# EAGLE design nes_controller_v1.0_v7 (EAGLE 7.7.0)
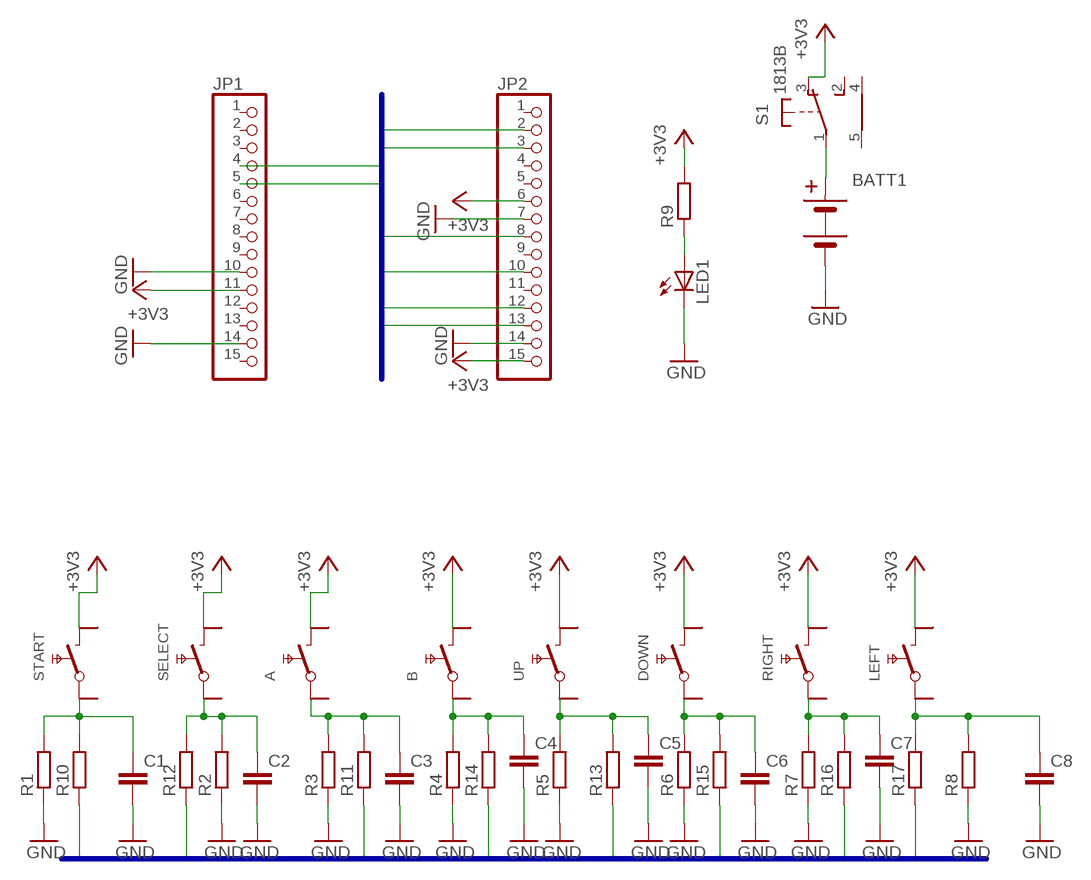
[diagram p0: schematic, sheet 1]

## Parts
A  SMDTAST  [SMDTAST]
B  SMDTAST  [SMDTAST]
BATT1  BATTERIEHALTER_2X_AAA  [BATTERIEHALTER]
C1  C-EUC0805K  [C0805K]
C2  C-EUC0805K  [C0805K]
C3  C-EUC0805K  [C0805K]
C4  C-EUC0805K  [C0805K]
C5  C-EUC0805K  [C0805K]
C6  C-EUC0805K  [C0805K]
C7  C-EUC0805K  [C0805K]
C8  C-EUC0805K  [C0805K]
DOWN  SMDTAST  [SMDTAST]
JP1  PINHD-1X15  [1X15]
JP2  PINHD-1X15  [1X15]
LED1  LED3MM  [LED3MM]
LEFT  SMDTAST  [SMDTAST]
R1  R-EU_MELF0207R  [MINI_MELF-0207R]
R2  R-EU_MELF0207R  [MINI_MELF-0207R]
R3  R-EU_MELF0207R  [MINI_MELF-0207R]
R4  R-EU_MELF0207R  [MINI_MELF-0207R]
R5  R-EU_MELF0207R  [MINI_MELF-0207R]
R6  R-EU_MELF0207R  [MINI_MELF-0207R]
R7  R-EU_MELF0207R  [MINI_MELF-0207R]
R8  R-EU_MELF0207R  [MINI_MELF-0207R]
R9  R-EU_MELF0207R  [MINI_MELF-0207R]
R10  R-EU_MELF0207R  [MINI_MELF-0207R]
R11  R-EU_MELF0207R  [MINI_MELF-0207R]
R12  R-EU_MELF0207R  [MINI_MELF-0207R]
R13  R-EU_MELF0207R  [MINI_MELF-0207R]
R14  R-EU_MELF0207R  [MINI_MELF-0207R]
R15  R-EU_MELF0207R  [MINI_MELF-0207R]
R16  R-EU_MELF0207R  [MINI_MELF-0207R]
R17  R-EU_MELF0207R  [MINI_MELF-0207R]
RIGHT  SMDTAST  [SMDTAST]
S1  1813B  [1813B]
SELECT  SMDTAST  [SMDTAST]
START  SMDTAST  [SMDTAST]
UP  SMDTAST  [SMDTAST]

## Nets
3§4: C2.1 R2.2 R12.2 SELECT.1
4$5: A.1 C3.1 R3.2 R11.2
+3V3: A.2 B.2 DOWN.2 JP1.11 JP2.6 JP2.15 LEFT.2 R9.2 RIGHT.2 S1.3(O) SELECT.2 START.2 UP.2
A: JP1.5 R11.1
B: JP1.4 R14.1
DOWN: JP2.8 R15.1
GND: BATT1.P- C1.2 C2.2 C3.2 C4.2 C5.2 C6.2 C7.2 C8.2 JP1.10 JP1.14 JP2.7 JP2.14 LED1.K(C) R1.1 R2.1 R3.1 R4.1 R5.1 R6.1 R7.1 R8.1
LEFT: JP2.10 R17.1
N$1: BATT1.P+ S1.1(W)
N$2: LED1.A R9.1
N$3: C1.1 R1.2 R10.2 START.1
N$4: B.1 C4.1 R4.2 R14.2
N$5: C5.1 R5.2 R13.2 UP.1
N$6: C6.1 DOWN.1 R6.2 R15.2
N$7: C7.1 R7.2 R16.2 RIGHT.1
N$8: C8.1 LEFT.1 R8.2 R17.2
RIGHT: JP2.13 R16.1
SELECT: JP2.2 R12.1
START: JP2.3 R10.1
UP: JP2.12 R13.1
Unconnected: A.11 A.22 B.11 B.22 DOWN.11 DOWN.22 JP1.1 JP1.2 JP1.3 JP1.6 JP1.7 JP1.8 JP1.9 JP1.12 JP1.13 JP1.15 JP2.1 JP2.4 JP2.5 JP2.9 JP2.11 LEFT.11 LEFT.22 RIGHT.11 RIGHT.22 S1.2(S) S1.4(SH1) S1.5(SH2) SELECT.11 SELECT.22 START.11 START.22 UP.11 UP.22

## Buses
SELECT,START,A,B,UP,DOWN,LEFT,RIGHT

## Library data of the parts
A B DOWN LEFT RIGHT SELECT START UP = Schalter-sh:SMDTAST
BATT1 = Taschenlampe:BATTERIEHALTER_2X_AAA: Batteriehalter 2x AAA, printbar
C1-C8 = rcl@1:C-EU: CAPACITOR, European symbol; SPICEPREFIX: C
JP1 JP2 = pinhead:PINHD-1X15: PIN HEADER
LED1 = led:LED: LED OSRAM: - CHIPLED LG R971, LG N971, LY N971, LG Q971, LY Q971, LO R971, LY R971 LH N974, LH R974 LS Q976, LO Q976, LY Q976 LO Q996 - Hyper CHIPLED LW Q18S LB Q993, LB Q99A, LB R99A - SideLED LS A670, LO A670, LY A670, LG A670, LP A670 LB A673, LV A673, LT A673, LW A673 LH A674 LY A675 LS A676, LA A676, LO A676, LY A676, LW A676 LS A679, LY A679, LG A679 - Hyper Micro SIDELED® LS Y876, LA Y876, LO Y876, LY Y876 LT Y87S - SmartLED LW L88C, LW L88S LB L89C, LB L89S, LG L890 LS L89K, LO L89K, LY L89K LS L896, LA L896, LO L896, LY L896 - TOPLED LS T670, LO T670, LY T670, LG T670, LP T670 LSG T670, LSP T670, LSY T670, LOP T670, LYG T670 LG T671, LOG T671, LSG T671 LB T673, LV T673, LT T673, LW T673 LH T674 LS T676, LA T676, LO T676, LY T676, LB T676, LH T676, LSB T676, LW T676 LB T67C, LV T67C, LT T67C, LS T67K, LO T67K, LY T67K, LW E67C LS E67B, LA E67B, LO E67B, LY E67B, LB E67C, LV E67C, LT E67C LW T67C LS T679, LY T679, LG T679 LS T770, LO T770, LY T770, LG T770, LP T770 LB T773, LV T773, LT T773, LW T773 LH T774 LS E675, LA E675, LY E675, LS T675 LS T776, LA T776, LO T776, LY T776, LB T776 LHGB T686 LT T68C, LB T68C - Hyper Mini TOPLED® LB M676 - Mini TOPLED Santana® LG M470 LS M47K, LO M47K, LY M47K Source: http://www.osram.convergy.de LUXEON: - LUMILED® LXK2-PW12-R00, LXK2-PW12-S00, LXK2-PW14-U00, LXK2-PW14-V00 LXK2-PM12-R00, LXK2-PM12-S00, LXK2-PM14-U00 LXK2-PE12-Q00, LXK2-PE12-R00, LXK2-PE12-S00, LXK2-PE14-T00, LXK2-PE14-U00 LXK2-PB12-K00, LXK2-PB12-L00, LXK2-PB12-M00, LXK2-PB14-N00, LXK2-PB14-P00, LXK2-PB14-Q00 LXK2-PR12-L00, LXK2-PR12-M00, LXK2-PR14-Q00, LXK2-PR14-R00 LXK2-PD12-Q00, LXK2-PD12-R00, LXK2-PD12-S00 LXK2-PH12-R00, LXK2-PH12-S00 LXK2-PL12-P00, LXK2-PL12-Q00, LXK2-PL12-R00 Source: www.luxeon.com KINGBRIGHT: KA-3528ASYC Source: www.kingbright.com
R1-R17 = rcl:R-EU_: RESISTOR, European symbol
S1 = Benutzer_WM:1813B

## Board
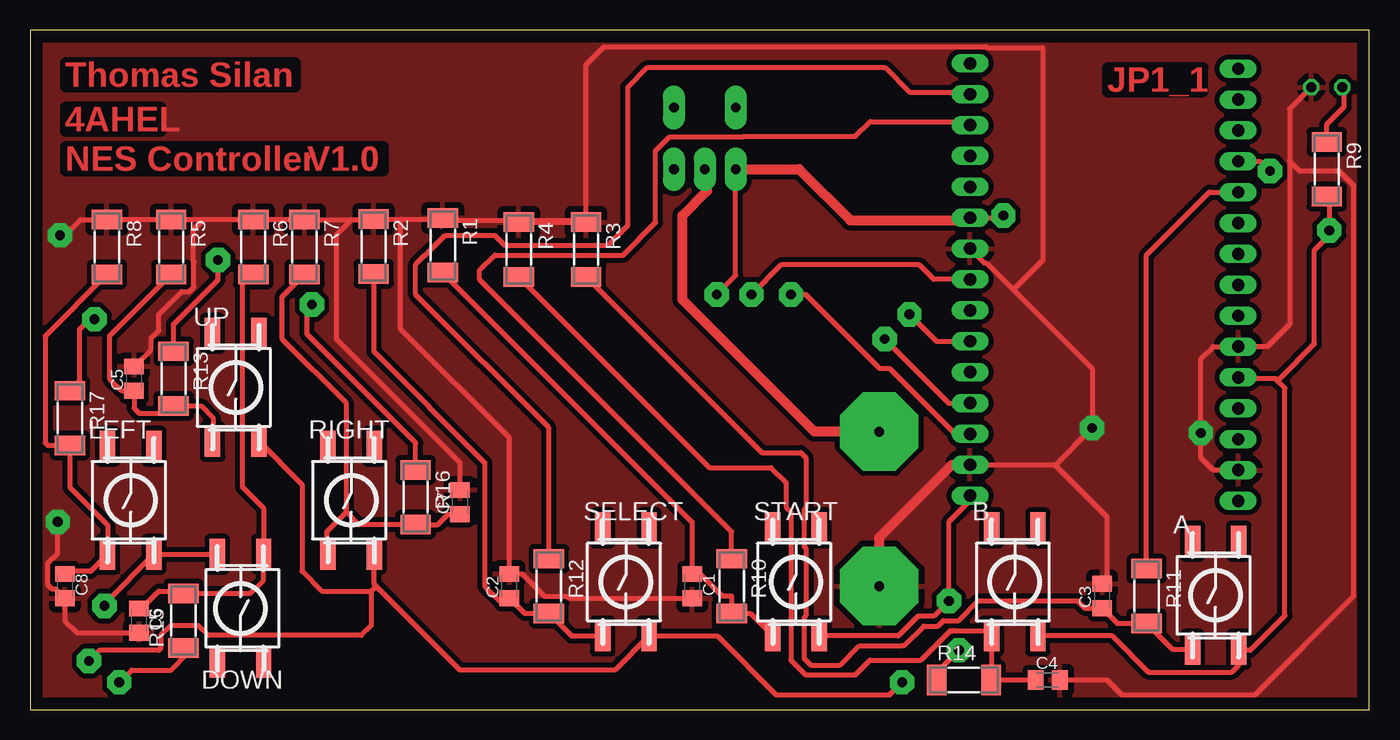
[diagram p1: board, top side]
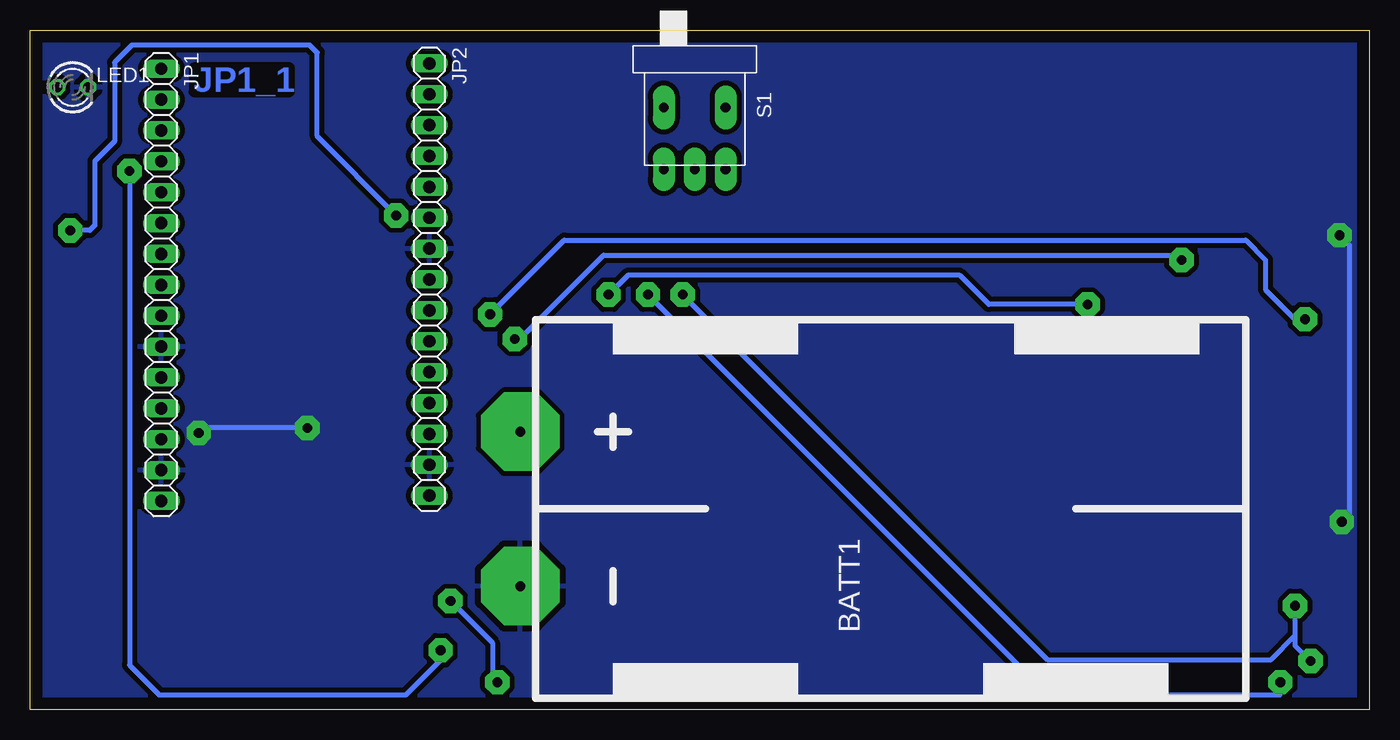
[diagram p2: board, bottom side, seen from below]

Size 110.16 x 55.87 mm. Coordinates in mm from the lower left corner, seen from the top.
Outline: 0,0 110.16,0 110.16,55.87 0,55.87 0,0
Copper layers (1*16): Top 0.035mm / dielectric 1.5mm / Bottom 0.035mm
Design rules "htl-klu": minimum track width 16mil, minimum drill 31mil, track to track 16mil, track to pad 16mil, pad to pad 16mil, via to via 16mil, smd to smd 12mil, copper to edge 40mil, drill to drill 16mil, minimum pad ring 10mil, minimum via ring 16mil, stop-mask expansion 4mil, vias tented up to drill 0mil, thermal gap 20mil

### Footprints (pad centres in the part's own frame; a part is rotated, then mirrored left to right if it is on the bottom)
SMDTAST = smd 1.27 x 2.54: 1 -1.905,-4.445; 2 1.905,-4.445; 11 -1.905,4.445; 22 1.905,4.445
BATTERIEHALTER = drill 0.813 pad 6.452 octagon: P+ 6.35,30.48; P- -6.35,30.48
C0805K = smd 1.3 x 1.6: 1 -1,0; 2 1,0
1X15 = drill 1.016 long: 1 -17.78,0; 2 -15.24,0; 3 -12.7,0; 4 -10.16,0; 5 -7.62,0; 6 -5.08,0; 7 -2.54,0; 8 0,0; 9 2.54,0; 10 5.08,0; 11 7.62,0; 12 10.16,0; 13 12.7,0; 14 15.24,0; 15 17.78,0
LED3MM = drill 0.813 octagon: A -1.27,0; K 1.27,0
MINI_MELF-0207R = smd 1.6 x 2.5: 1 -2.25,0; 2 2.25,0
1813B = drill 0.8 pad 1.8 long: 1 0,0; 2 0,2.54; 3 0,-2.54; 4 -5.08,2.54; 5 -5.08,-2.54

### Placement (x,y rotation side)
A  97.52,9.41 0 top
B  81,10.5 0 top
BATT1  39.37,16.51 90 bottom
C1  54.46,10.16 270 top
C2  39.42,10.16 90 top
C3  88.19,9.35 90 top
C4  83.72,2.44 0 top
C5  8.53,27.23 90 top
C6  8.94,7.32 270 top
C7  35.36,17.07 90 top
C8  2.84,10.16 270 top
DOWN  17.29,8.33 180 top
JP1  99.39,34.94 270 bottom
JP2  77.33,35.38 270 bottom
LED1  106.68,51.2 0 bottom
LEFT  8.26,17.22 0 top
R1  33.93,38.2 270 top
R2  28.24,38.1 270 top
R3  45.72,37.85 270 top
R4  40.18,37.85 270 top
R5  11.58,38.05 270 top
R6  18.34,38.05 270 top
R7  22.56,38.05 270 top
R8  6.3,38.05 270 top
R9  106.68,44.45 270 top
R10  57.71,10.16 270 top
R11  91.85,9.35 270 top
R12  42.67,10.16 270 top
R13  11.79,27.23 270 top
R14  76.81,2.44 0 top
R15  12.6,7.32 90 top
R16  31.7,17.48 270 top
R17  3.25,23.98 270 top
RIGHT  26.4,17.22 0 top
S1  55.5,44.45 270 bottom
SELECT  49,10.5 0 top
START  63,10.5 0 top
UP  16.9,26.5 0 top

### Tracks (layer width: path | path; a pad name or v marks a point on that pad's centre or on a via)
3§4
  Top 0.406: SELECT.1 44.53,6.05 R12.2 40.67,7.91 C2.1 39.2,8.94 38.61,8.94 37.39,10.16 37.39,20.32 28.25,29.46 R2.2
4$5
  Top 0.406: R3.2 60.18,21.13 63.4,21.13 63.8,20.73 63.8,16.61 63.66,16.47 63.66,13.42 63.8,13.28 63.8,7.72 63.66,7.58 63.66,4.21 64.21,3.66 66.65,3.66 68.23,5.24 71.76,5.24 71.8,5.28 71.93,5.28 73.52,6.87 74.67,6.87 75.11,7.32 76.4,7.32 78.03,8.94 86.16,8.94 86.75,8.35 C3.1 89.44,7.1 R11.2 93.98,4.96 A.1
+3V3  (via drill 0.8 pad 2)
  Top 0.406: 99.7,27.64 99.64,27.57 | 99.64,27.57 JP1.11 | A.2 99.42,4.88 | 99.42,4.88 99.42,3.66 98.85,3.08 92.01,3.08 89.04,6.05 B.2 | DOWN.2 LEFT.2 6.1,8.71 v6.1,8.53 | UP.2 22.35,18.51 22.35,11.38 23.98,9.75 28.04,9.75 | 28.04,9.75 28.45,10.16 | 28.45,10.16 28.3,10.3 RIGHT.2 | 28.45,10.16 35.36,3.25 48.1,3.25 SELECT.2 56.53,6.05 61.37,1.22 70.71,1.22 v71.73,2.25 | 99.42,4.88 100.38,4.88 103.23,7.72 103.23,26.42 102.41,27.23 | 99.64,27.57 99.97,27.23 102.41,27.23 | 102.41,27.23 102.82,27.23 105.66,30.07 105.66,37.8 106.88,39.01 v106.88,39.42 106.88,42 R9.2 | v56.49,34.14 58.04,35.69 S1.3 | 28.04,9.75 28.04,6.91 27.23,6.1 14.63,6.1 13.82,6.91 11.53,6.91 10.74,6.12 10.74,5.05 10.57,4.88 5.69,4.88 v4.82,4 | START.2 71.42,6.05 73.05,7.68 74.33,7.68 v75.59,8.94 75.59,15.44 77.33,17.18 JP2.15 | JP2.6 80.29,40.46 80.47,40.64 v80.06,40.64
  Top 0.813: S1.3 63.25,44.45 67.46,40.23 77.1,40.23 JP2.6
  Bottom 0.406: v6.1,8.53 6.1,6.1 | v56.49,34.14 26.42,4.06 8.13,4.06 6.1,6.1 | v75.59,8.94 72.14,5.49 72.14,2.65 v71.73,2.25 | v80.06,40.64 86.56,47.14 86.56,54.05 87.16,54.65 101.81,54.65 103.23,53.24 103.23,46.74 104.85,45.11 104.85,39.83 105.26,39.42 v106.88,39.42 | 6.1,6.1 6.1,5.28 v4.82,4
A
  Top 0.406: R11.1 91.85,37.39 97.02,42.56 JP1.5
B  (via drill 0.8 pad 2)
  Top 0.406: JP1.4 101.2,45.1 v102.01,44.3 | 73.96,1.84 R14.1 74.56,3.06 | 74.37,3.25 74.56,3.06 | v76.4,4.88 74.59,3.06 74.56,3.06
  Bottom 0.406: v102.01,44.3 102.01,3.66 99.57,1.22 79.25,1.22 76.4,4.06 v76.4,4.88
DOWN  (via drill 0.8 pad 2)
  Top 0.406: R15.1 13.01,4.66 11.6,3.25 8.32,3.25 v7.32,2.25 7.32,2.85 | JP2.8 74.35,35.38 73.15,36.58 61.77,36.58 v59.33,34.14
  Bottom 0.406: v59.33,34.14 26.42,1.22 7.32,1.22 v7.32,2.25
GND  (via drill 0.8 pad 2)
  Top 0.406: 14.22,40.3 R6.1 R7.1 26.42,40.3 | 14.22,40.3 R5.1 R8.1 4.13,40.3 2.85,39.01 v2.44,39.01 | 26.42,40.3 28.19,40.3 R2.1 30.48,40.35 | 30.48,40.35 33.83,40.35 R1.1 34.15,40.23 45.58,40.23 R3.1 | R4.1 R3.1 | C6.2 3.85,6.32 2.85,7.32 C8.2 2.1,9.9 1.79,9.9 1.44,10.26 1.44,12.06 2.25,12.87 v2.25,15.44 | LED1.K 103.63,49.42 103.63,45.11 | 103.63,45.11 103.63,31.7 101.79,29.86 JP1.10 97.32,29.86 96.32,28.85 v96.32,22.76 96.32,20.73 97.34,19.7 JP1.14 | JP2.14 84.31,20.14 84.33,20.12 | 84.33,20.12 88.59,15.85 88.59,10.75 C3.2 | C4.2 88.59,2.44 89.81,1.22 100.79,1.22 108.92,9.35 108.92,43.08 107.7,44.3 104.44,44.3 103.63,45.11 | 30.48,40.35 30.48,31.29 39.42,22.35 C2.2 40.45,11.16 42.29,9.32 44.17,9.32 44.33,9.16 C1.2 | C7.2 35.36,20.32 25.2,30.48 25.2,39.08 26.42,40.3 | C5.2 9.93,29.62 9.93,30.53 10.57,31.17 10.57,32.51 12.44,34.39 13.09,34.39 13.44,34.75 13.44,36.85 13.41,36.88 13.41,39.49 14.22,40.3 | 84.33,20.12 v87.38,23.16 87.38,28.04 80.87,34.54 | JP2.7 78.5,36.75 78.66,36.75 80.87,34.54 | R3.1 45.72,53.03 47.22,54.53 78.66,54.53 78.73,54.46 83.31,54.46 83.31,36.98 80.87,34.54
  Top 0.813: BATT1.P- 69.85,14.17 75.82,20.14 JP2.14
  Bottom 0.406: v87.38,23.16 95.91,23.16 v96.32,22.76 | v2.25,15.44 1.63,16.06 1.63,38.2 v2.44,39.01
  pour Bottom: 0.41,55.68 109.73,55.68 109.73,0.41 0.41,0.41
  pour Top: 0.41,55.68 109.73,55.68 109.73,0.41 0.41,0.41
LEFT  (via drill 0.8 pad 2)
  Top 0.406: R17.1 4.06,27.04 4.06,31.29 4.88,32.11 v5.28,32.11 | v72.34,32.51 74.55,30.3 JP2.10
  Bottom 0.406: 72.75,32.11 v72.34,32.51 66.24,38.61 10.16,38.61 8.53,36.98 8.53,34.54 6.1,32.11 v5.28,32.11
N$1
  Top 0.508: 55.68,44.27 S1.1
  Top 0.813: BATT1.P+ 64.52,22.86 53.65,33.73 53.65,40.64 55.68,42.67 55.68,44.27
N$2
  Top 0.406: R9.1 106.68,48.16 108.1,49.58 108.1,51.05 LED1.A
N$3
  Top 0.406: R1.2 54.46,15.43 C1.1 55.08,11.16 56.9,9.35 57.71,9.35 R10.2 59.24,7.91 START.1
N$4
  Top 0.406: R4.2 55.87,19.91 60.96,19.91 62.18,18.69 62.18,16.66 62.59,16.26 62.59,4.06 63.8,2.85 67.87,2.85 69.09,4.06 73.27,4.06 75.69,6.49 75.98,6.49 76,6.5 78.65,6.5 B.1 79.09,2.47 R14.2 C4.1
N$5
  Top 0.406: R5.2 6.5,30.72 6.5,27.23 7.5,26.23 C5.1 8.53,24.79 8.94,24.38 11.19,24.38 R13.2 14.04,24.98 15.04,23.98 15.04,22.01 | 15.04,21.54 15.04,22.01 | 15.04,22.01 UP.1
N$6
  Top 0.406: C6.1 9.13,8.31 10.57,9.75 12.41,9.75 R15.2 18.1,9.56 19.2,10.66 DOWN.1 19.2,16.57 17.48,18.29 17.48,35.71 17.53,35.76 17.56,35.8 R6.2
N$7
  Top 0.406: 26.01,16.26 26.01,25.2 20.73,30.48 20.73,33.97 R7.2 | 26.01,16.26 24.38,14.63 24.38,12.89 RIGHT.1 | 26.01,16.26 27.04,15.22 R16.2 33.51,15.22 34.36,16.07 C7.1
N$8
  Top 0.406: R8.2 1.22,30.72 1.22,21.95 1.44,21.73 R17.2 3.25,18.29 6.36,15.18 LEFT.1 4.96,11.38 3.06,11.38 C8.1
RIGHT  (via drill 0.8 pad 2)
  Top 0.406: v62.59,34.14 63.8,34.14 69.9,28.04 70.71,28.04 76.08,22.68 JP2.13 | R16.1 31.7,21.95 22.76,30.89 22.76,32.92 v23.16,33.33
  Bottom 0.406: v62.59,34.14 60.96,35.76 33.73,35.76 31.29,33.33 v23.16,33.33
SELECT
  Top 0.406: JP2.2 77.15,50.8 72.34,50.8 70.31,52.83 50.8,52.83 49.17,51.21 49.17,39.83 47.55,38.2 39.01,38.2 38.2,39.01 34.14,39.01 32.48,37.36 32.43,37.36 31.7,36.63 31.7,34.14 31.9,33.93 42.67,23.16 R12.1
START
  Top 0.406: R10.1 57.71,14.63 36.98,35.36 36.98,36.17 38.2,37.39 48.77,37.39 51.45,40.07 51.45,45.98 52.6,47.12 58.66,47.12 58.69,47.14 67.87,47.14 69.09,48.36 77.05,48.36 JP2.3
UP  (via drill 0.8 pad 2)
  Top 0.406: R13.1 11.79,31.7 15.44,35.36 v15.44,36.98 | v70.31,30.48 75.59,25.2 77.31,25.2 JP2.12
  Bottom 0.406: v70.31,30.48 69.9,30.48 62.99,37.39 15.44,37.39 v15.44,36.98

### Text on the board
Top: Thomas Silan | JP1_1 | 4AHEL | NES Controller | V1.0
Bottom: JP1_1